# Altium schematic sheet Power and Voltage Regulators.SchDoc
size A; SheetNumber: 3; SheetTotal: 2
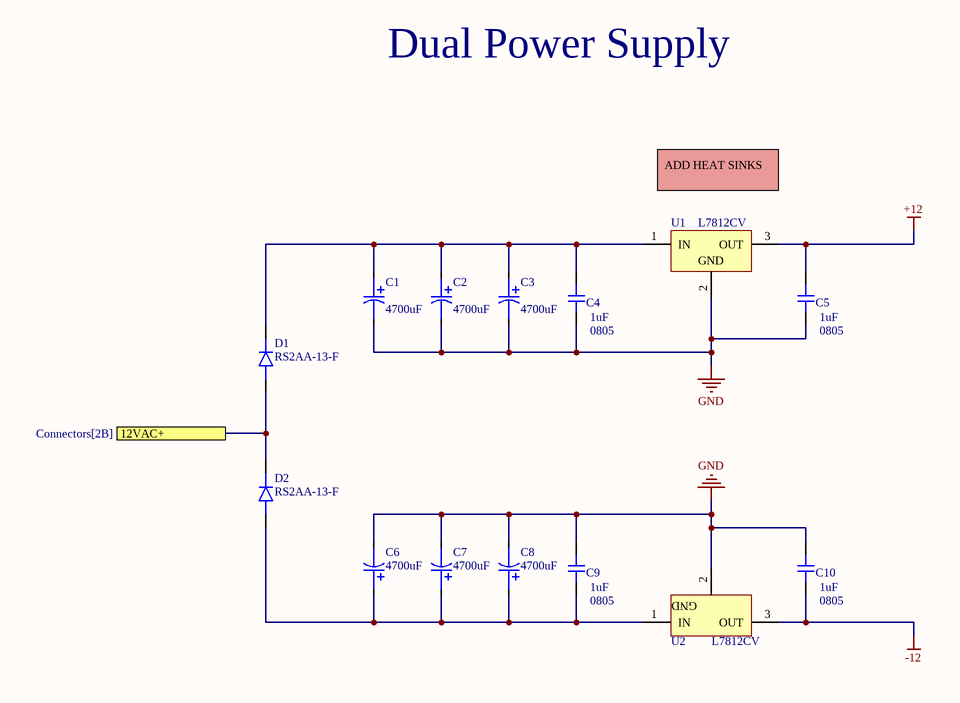
[diagram p0: Power and Voltage Regulators.SchDoc]

## Parts
C1  value 4700uF  [Radial Capacitor 7.5mm Pitch]  (hidden comment: 478CKS035M)
C2  value 4700uF  [Radial Capacitor 7.5mm Pitch]  (hidden comment: 478CKS035M)
C3  value 4700uF  [Radial Capacitor 7.5mm Pitch]  (hidden comment: 478CKS035M)
C4  value 1uF  Case/Package: 0805  [0805-CAP]  (hidden comment: Ceramic Capacitor)
C5  value 1uF  Case/Package: 0805  [0805-CAP]  (hidden comment: Ceramic Capacitor)
C6  value 4700uF  [Radial Capacitor 7.5mm Pitch]  (hidden comment: 478CKS035M)
C7  value 4700uF  [Radial Capacitor 7.5mm Pitch]  (hidden comment: 478CKS035M)
C8  value 4700uF  [Radial Capacitor 7.5mm Pitch]  (hidden comment: 478CKS035M)
C9  value 1uF  Case/Package: 0805  [0805-CAP]  (hidden comment: Ceramic Capacitor)
C10  value 1uF  Case/Package: 0805  [0805-CAP]  (hidden comment: Ceramic Capacitor)
D1  RS2AA-13-F  [DIOM4326X23N]
D2  RS2AA-13-F  [DIOM4326X23N]
U1  L7812CV  [TO220]
U2  L7812CV  [TO220]

## Ports
12VAC+ (see Connectors[2B])

## Nets
+12: C5.1 U1.3(OUT)
-12: C10.2 U2.3(OUT)
GND: C1.1 C2.1 C3.1 C4.2 C5.2 C6.1 C7.1 C8.1 C9.1 C10.1 U1.2(GND) U2.2(GND)
12VAC+: D1.2 D2.1 ; port 12VAC+
NetC1_2: C1.2 C2.2 C3.2 C4.1 D1.1 U1.1(IN)
NetC6_2: C6.2 C7.2 C8.2 C9.2 D2.2 U2.1(IN)

## Notes on the sheet
- Dual Power Supply
- ADD HEAT SINKS

## Library data of the parts
C1-C3 C6-C8 = 478CKS035M: Aluminum Electrolytic Capacitors - Leaded 4700uF 35 Volts 20% LYTICS/IC; Manufacturer: Cornell Dubilier; Supplier: Newark; Supplier Part Number: 84M5175; Manufacturer Part Number: 478CKS035M; RoHS: Yes; Category: Capacitors; Stock: 101; Pricing: 1=1.58, 10=1.45, 25=1.45, 50=1.45, 100=1.34, 500=1.34 (USD); ComponentLink1URL: https://datasheet.ciiva.com/16317/ckr-cks-16317831.pdf?src-supplier=Future+Electronics; ComponentLink1Description: https://datasheet.ciiva.com/16317/ckr-cks-16317831.pdf?src-supplier=Future+Electronics
C4 C5 C9 C10 = Cap: Ceramic Capacitor, Multilayer, Ceramic, 50V, 10% +Tol, 10% -Tol, X7R, 15% TC, 1uF, Surface Mount, 0805; Manufacturer: Samsung; Manufacturer Part Number: CL21B105KBFNNNE; Multilayer: Yes; Supplier: Avnet; Supplier Part Number: CL21B105KBFNNNE; RoHS: Yes; Category: Ceramic Capacitors; Stock: 160000; Pricing: 2000=0.01319, 4000=0.01289, 8000=0.01258, 12000=0.01228, 16000=0.01198 (USD); Mounting Technology: Surface Mount; Pins: 2; Dielectric Material: Ceramic; Package Shape: Rectangular; Terminal Finish: Nickel; Min Operating Temperature: -55°C; Max Operating Temperature: 125°C; JESD-609 Code: e3; Capacitor Type: Ceramic; Tolerance  (fill in as +-): 10%; Package Style: SMTMeter; Packaging: Tape and Reel; Tolerance (fill in as +-): 10%; Rated DC Voltage (URdc): 50V; Temperature Characteristics Code: X7R; Termination: Wraparound; Length: 2mm; Width: 1.25mm; Height: 1.35mm; Reach SVHC Compliant: Yes; RoHS Compliant: Yes; ComponentLink1URL: https://datasheet.ciiva.com:443/pdfs/VipMasterIC/IC/SEMS/SEMS-S-A0008524728/SEMS-S-A0008523023-1.pdf?src-supplier=IHS+Markit; ComponentLink1Description: https://datasheet.ciiva.com:443/pdfs/VipMasterIC/IC/SEMS/SEMS-S-A0008524728/SEMS-S-A0008523023-1.pdf?src-supplier=IHS+Markit; ComponentLink2URL: https://media.digikey.com/pdf/Data%20Sheets/Samsung%20PDFs/CL_Series_MLCC_ds.pdf?src-supplier=Digikey; ComponentLink2Description: https://media.digikey.com/pdf/Data%20Sheets/Samsung%20PDFs/CL_Series_MLCC_ds.pdf?src-supplier=Digikey; ComponentLink3URL: http://www.farnell.com/datasheets/2710563.pdf?src-supplier=Farnell; ComponentLink3Description: http://www.farnell.com/datasheets/2710563.pdf?src-supplier=Farnell; ComponentLink4URL: https://datasheet.octopart.com/CL21B105KBFNNNE-Samsung-Electro-Mechanics-datasheet-11733377.pdf?src-supplier=Future+Electronics; ComponentLink4Description: https://datasheet.octopart.com/CL21B105KBFNNNE-Samsung-Electro-Mechanics-datasheet-11733377.pdf?src-supplier=Future+Electronics
D1 D2 = RS2AA-13-F: Rectifier Diode, 1 Phase, 1 Element, 1.5A, 50V V(RRM), Silicon; Manufacturer: Diodes; Package Body Material: Plastic; Application(s): EFFICIENCY; Forward Voltage: 1.3V; Non-rep Pk Forward Current-Max: 50A; Number of Elements: 1; Reverse Recovery Time-Max: 0.15us; Time @ Peak Reflow Temperature-Max (s): 40s; Qualification Status: Not Qualified; Supplier: Newark; Supplier Part Number: 29AK5192; Manufacturer Part Number: RS2AA-13-F; RoHS: Yes; Category: Rectifier Diodes; Stock: 4870; Pricing: 5=0.381, 10=0.303, 25=0.264, 50=0.226, 100=0.187, 250=0.181, 500=0.175, 1000=0.124 (USD); Pins: 2; Diode Element Material: SILICON; Package Shape: Rectangular; Terminal Finish: Tin; Min Operating Temperature: -65°C; Max Operating Temperature: 150°C; JESD-609 Code: e3; Diode Type: RECTIFIER; JESD-30 Code: R-PDSO-C2; Moisture Sensitivity Level: 1; Number of Phases: 1; Max Output current: 1.5A; Package Style: SMALL OUTLINEMeter; Peak Reflow Temperature (Cel): 260°C; Rep Pk Reverse Voltage-Max: 50V; Surface Mount: Yes; Terminal Form: C BEND; Terminal Position: DUAL; RoHS Compliant: Yes; Reach SVHC Compliant: No; ComponentLink1URL: https://datasheet.ciiva.com:443/pdfs/VipMasterIC/IC/DIOD/DIODS13030/DIODS13030-1.pdf?src-supplier=IHS+Markit; ComponentLink1Description: https://datasheet.ciiva.com:443/pdfs/VipMasterIC/IC/DIOD/DIODS13030/DIODS13030-1.pdf?src-supplier=IHS+Markit; ComponentLink2URL: https://datasheet.ciiva.com/16483/ds15004-16483689.pdf?src-supplier=Future+Electronics; ComponentLink2Description: https://datasheet.ciiva.com/16483/ds15004-16483689.pdf?src-supplier=Future+Electronics
U1 U2 = L7812CV: Fixed Positive Standard Regulator, 12VBIPolar, PSFM3; Manufacturer: STMicroelectronics; Max Supply Voltage: 30V; Min Input Voltage: 14.5V; Channels: 1; Output Current1-Max: 1.5A; Output Voltage1-Max: 12.6V; Output Voltage1-Min: 11.4V; Output Voltage1-Nom: 12V; Regulator Type: FIXED POSITIVE SINGLE OUTPUT STANDARD REGULATOR; Surface Mount: No; Qualification Status: Not Qualified; PackageDescription: TO, Thru-Hole, Vertical, Heatsink Mounted; 3 In-Line Leads; Pitch 2.54 mm; ComponentLink3URL: http://www.st.com/internet/com/TECHNICAL_RESOURCES/TECHNICAL_LITERATURE/PACKAGE_INFORMATION/CD00004649.pdf; ComponentLink1URL: http://www.st.com; ComponentLink2Description: Datasheet; ComponentLink3Description: Package Specification; ComponentLink2URL: http://www.st.com/internet/com/TECHNICAL_RESOURCES/TECHNICAL_LITERATURE/DATASHEET/CD00000444.pdf; DatasheetVersion: 16/11/2011; PackageVersion: ver3.0; PackageReference: TO220; ComponentLink1Description: Manufacturer URL; Supplier: Mouser; Supplier Part Number: 511-L7812CV; Manufacturer Part Number: L7812CV; RoHS: Yes; Category: Voltage Regulators - Linear; Stock: 31967; Pricing: 1=0.6, 10=0.465, 50=0.465, 100=0.401, 250=0.381, 500=0.339, 1000=0.289, 2000=0.264, 5000=0.259, 10000=0.258 (USD); Pins: 3; Package Shape: Rectangular; Terminal Finish: Tin; JESD-609 Code: e3; Operating Temperature, TJ-Max: 125°C; Operating Temperature, TJ-Min: 0°C; Package Style: FLANGE MOUNTMeter; Technology: BIPOLAR; Terminal Form: Through Hole; Terminal Position: SINGLE; RoHS Compliant: Yes; Reach SVHC Compliant: No; ComponentLink4URL: https://datasheet.ciiva.com:443/pdfs/VipMasterIC/IC/SGST/SGST-S-A0006334694/SGST-S-A0006334694-1.pdf?src-supplier=IHS+Markit; ComponentLink4Description: https://datasheet.ciiva.com:443/pdfs/VipMasterIC/IC/SGST/SGST-S-A0006334694/SGST-S-A0006334694-1.pdf?src-supplier=IHS+Markit; ComponentLink5URL: https://datasheet.ciiva.com/19456/889305-19456372.pdf?src-supplier=Jameco; ComponentLink5Description: https://datasheet.ciiva.com/19456/889305-19456372.pdf?src-supplier=Jameco; ComponentLink6URL: https://datasheet.ciiva.com/15111/getdatasheetpartid-93787-15111629.pdf?src-supplier=Verical; ComponentLink6Description: https://datasheet.ciiva.com/15111/getdatasheetpartid-93787-15111629.pdf?src-supplier=Verical; ComponentLink7URL: https://datasheet.ciiva.com/29156/156053-da-01-en-spannungsregler-l7812cv-to220-stm-29156878.pdf?src-supplier=Conrad; ComponentLink7Description: https://datasheet.ciiva.com/29156/156053-da-01-en-spannungsregler-l7812cv-to220-stm-29156878.pdf?src-supplier=Conrad; ComponentLink8URL: https://datasheet.ciiva.com/29157/179230-da-01-en-spannungsregler-ic-l7812cv-to-220-stm-29157837.pdf?src-supplier=Conrad; ComponentLink8Description: https://datasheet.ciiva.com/29157/179230-da-01-en-spannungsregler-ic-l7812cv-to-220-stm-29157837.pdf?src-supplier=Conrad; ComponentLink9URL: https://datasheet.ciiva.com/14111/tel78xx-l78xxc-e-14111397.pdf?src-supplier=Distrelec; ComponentLink9Description: https://datasheet.ciiva.com/14111/tel78xx-l78xxc-e-14111397.pdf?src-supplier=Distrelec; ComponentLink10URL: https://datasheet.ciiva.com/6884/1805459-6884955.pdf?src-supplier=Newark; ComponentLink10Description: https://datasheet.ciiva.com/6884/1805459-6884955.pdf?src-supplier=Newark; ComponentLink11URL: https://datasheet.ciiva.com/1511/1805459-1511927.pdf?src-supplier=Element14; ComponentLink11Description: https://datasheet.ciiva.com/1511/1805459-1511927.pdf?src-supplier=Element14; ComponentLink12URL: https://datasheet.ciiva.com/16508/cd00000444-16508249.pdf?src-supplier=Future+Electronics; ComponentLink12Description: https://datasheet.ciiva.com/16508/cd00000444-16508249.pdf?src-supplier=Future+Electronics